# Altium schematic sheet [1X - JTAG, DEBUG.SchDoc
size 513 x 386 mm
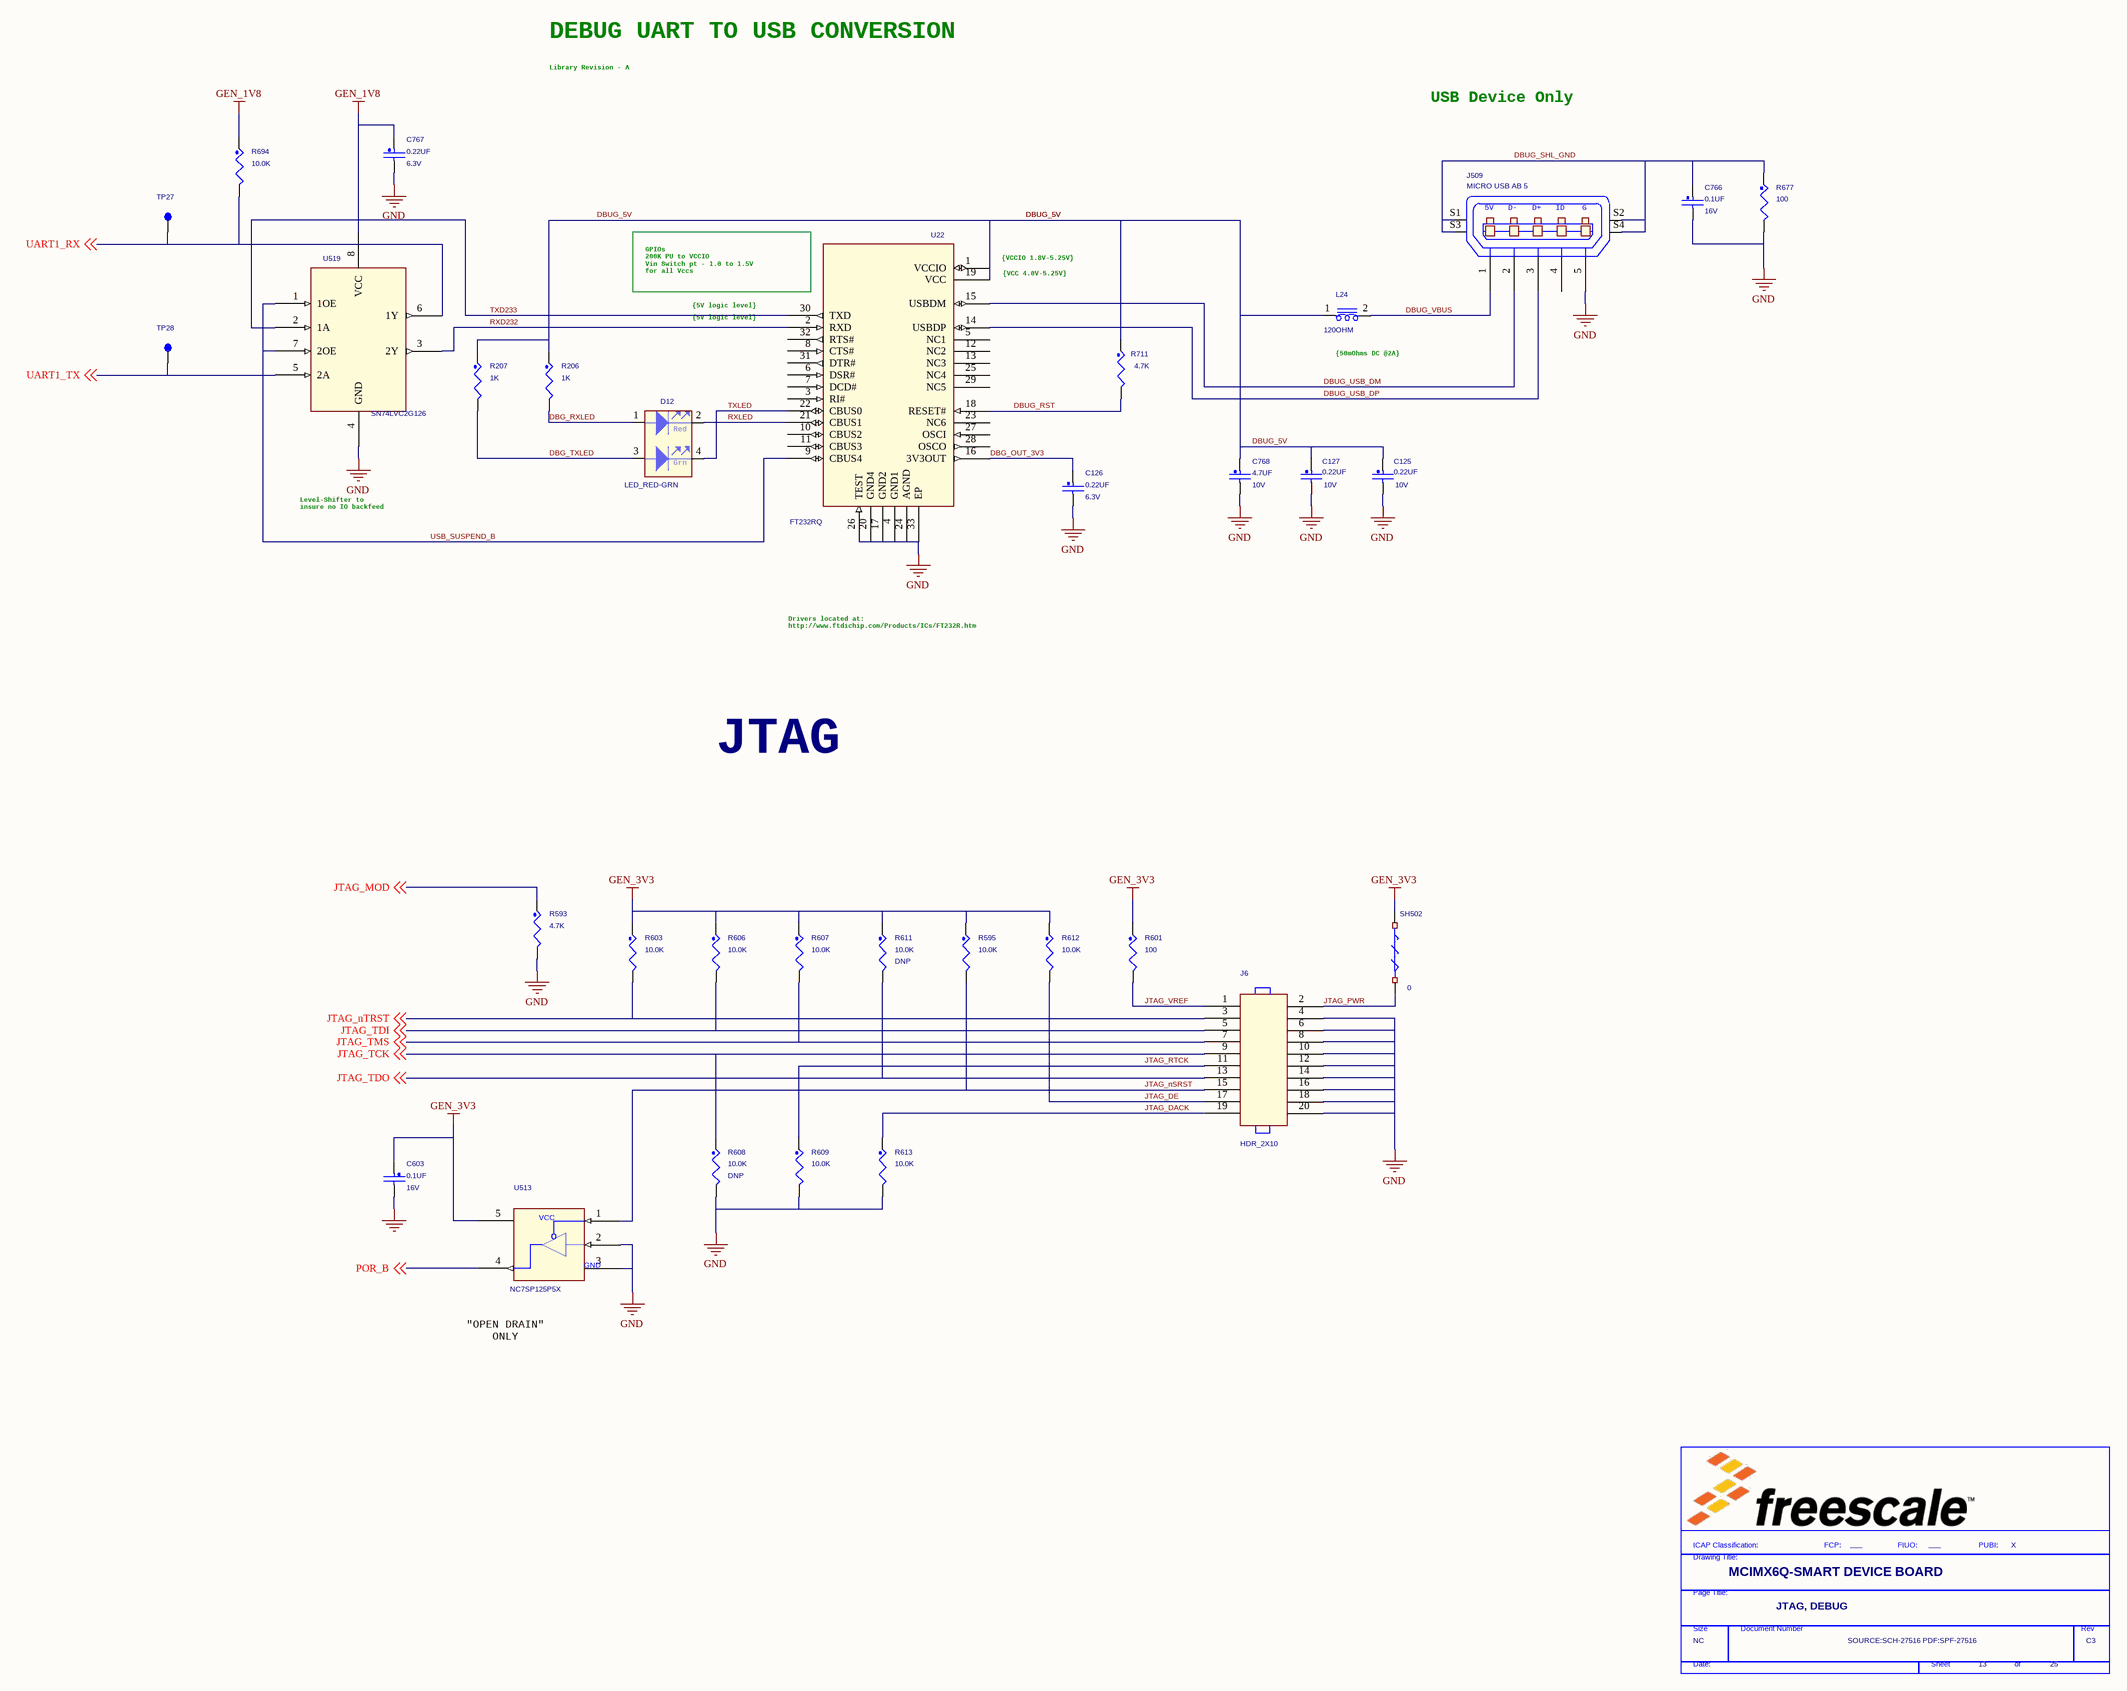
[diagram p0: [1X - JTAG, DEBUG.SchDoc]

## Parts
*  FIUO: ___  PUBI: X  Doc: SOURCE:SCH-27516 PDF:SPF-27516  RevCode: C3  Title: MCIMX6Q-SMART DEVICE BOARD  Page Size: NC  Page Number: 13  Page Count: 25  PageTitle: JTAG, DEBUG  (hidden comment: TitleBlock_FS)  (graphical)
C125  0.22UF  VOLTAGE: 10V  [0201_CC]
C126  0.22UF  Voltage: 6.3V  [0201_CC]
C127  0.22UF  VOLTAGE: 10V  [0201_CC]
C603  0.1UF  WVDC: 16V  [0402_CC]
C766  0.1UF  WVDC: 16V  [0402_CC]
C767  0.22UF  Voltage: 6.3V  [0201_CC]
C768  4.7UF  WVDC: 10V  [0603_CC]
D12  LED_RED-GRN  [LED_DUAL_3025MM_SM]
J6  HDR_2X10  [hdr_20m_100_th]
J509  MICRO USB AB 5  [con5_microusb]
L24  120OHM  [0603_CC]
R206  1K  [0201_CC]
R207  1K  [0201_CC]
R593  4.7K  [0402_CC]
R595  10.0K  [0402_CC]
R601  100  [0402_CC]
R603  10.0K  [0402_CC]
R606  10.0K  [0402_CC]
R607  10.0K  [0402_CC]
R608  10.0K  ASSY_OPT: DNP  [0402_CC]
R609  10.0K  [0402_CC]
R611  10.0K  ASSY_OPT: DNP  [0402_CC]
R612  10.0K  [0402_CC]
R613  10.0K  [0402_CC]
R677  100  [0402_CC]
R694  10.0K  [0402_CC]
R711  4.7K  [0402_CC]
SH502  0  [SH0402_CC]
TP27  TEST POINT  [C035S]  (value not drawn)
TP28  TEST POINT  [C035S]  (value not drawn)
U22  FT232RQ  [qfn32_mc1320x]
U513  NC7SP125P5X  [SC70-5_A]
U519  SN74LVC2G126  [SSOP8]

## Nets
GEN_1V8: C767.1 R694.1 U519.8(VCC)
GEN_3V3: C603.1 R595.1 R601.1 R603.1 R606.1 R607.1 R611.1 R612.1 SH502.1 U513.5(VCC)
GND: C125.2 C126.2 C127.2 C603.2 C766.2 C767.2 C768.2 J6.4 J6.6 J6.8 J6.10 J6.12 J6.14 J6.16 J6.18 J6.20 J509.5(P5) R593.2 R608.2 R609.2 R613.2 R677.2 U22.4(GND1) U22.17(GND2) U22.20(GND4) U22.24(AGND) U22.26(TEST) U22.33(EP) U513.2(A) U513.3(GND) U519.4(GND)
DBG_OUT_3V3: C126.1 U22.16(3V3OUT)
DBG_RXLED: D12.1(ANODE1) R206.2
DBG_TXLED: D12.3(ANODE2) R207.2
DBUG_5V: C125.1 C127.1 C768.1 L24.1 R206.1 R207.1 R711.1 U22.1(VCCIO) U22.19(VCC)
DBUG_RST: R711.2 U22.18(RESET#)
DBUG_SHL_GND: C766.1 J509.S1(SHLD1) J509.S2(SHLD2) J509.S3(SHLD3) J509.S4(SHLD4) R677.1
DBUG_USB_DM: J509.2(P2) U22.15(USBDM)
DBUG_USB_DP: J509.3(P3) U22.14(USBDP)
DBUG_VBUS: J509.1(P1) L24.2
JTAG_DACK: J6.19 R613.1
JTAG_DE: J6.17 R612.2
JTAG_MOD: R593.1 ; off-sheet JTAG_MOD
JTAG_nSRST: J6.15 R595.2 U513.1(~{OE})
JTAG_nTRST: J6.3 R603.2 ; off-sheet JTAG_nTRST
JTAG_PWR: J6.2 SH502.2
JTAG_RTCK: J6.11 R609.1
JTAG_TCK: J6.9 R608.1 ; off-sheet JTAG_TCK
JTAG_TDI: J6.5 R606.2 ; off-sheet JTAG_TDI
JTAG_TDO: J6.13 R611.2 ; off-sheet JTAG_TDO
JTAG_TMS: J6.7 R607.2 ; off-sheet JTAG_TMS
JTAG_VREF: J6.1 R601.2
POR_B: U513.4(Y) ; off-sheet POR_B
RXD232: U22.2(RXD) U519.3(2Y)
RXLED: D12.2(CATHODE1) U22.21(CBUS1)
TXD233: U22.30(TXD) U519.2(1A)
TXLED: D12.4(CATHODE2) U22.22(CBUS0)
UART1_RX: R694.2 TP27.1(Pin1) U519.6(1Y) ; off-sheet UART1_RX
UART1_TX: TP28.1(Pin1) U519.5(2A) ; off-sheet UART1_TX
USB_SUSPEND_B: U22.9(CBUS4) U519.1(1OE) U519.7(2OE)

Not connected (* = marked no-connect by the designer): J509 4(P4); U22 3(RI#) 5(NC1) 6(DSR#) 7(DCD#) 8(CTS#) 10(CBUS2) 11(CBUS3) 12(NC2) 13(NC3) 23(NC6) 25(NC4) 27(OSCI) 28(OSCO) 29(NC5) 31(DTR#) 32(RTS#)

## Notes on the sheet
- DEBUG UART TO USB CONVERSION
- Library Revision - A
- USB Device Only
- (near U22) GPIOs
  200K PU to VCCIO
  Vin Switch pt - 1.0 to 1.5V
  for all Vccs
- {VCCIO 1.8V-5.25V}
- {VCC 4.0V-5.25V}
- {5V logic level}
- (near L24) {50mOhms DC @2A}
- Level-Shifter to
  insure no IO backfeed
- Drivers located at:
  http://www.ftdichip.com/Products/ICs/FT232R.htm
- JTAG
- "OPEN DRAIN"
  ONLY
- (in symbol LED_DUAL_SEP_RG) Red; Grn
- (in symbol TitleBlock_FS) ICAP Classification:; FCP:; FIUO:; PUBI:; Drawing Title:; Page Title:; Size; Document Number; Rev; Date:; Sheet; of
- (in symbol USB_MINI_AB_RECEPTACLE) 5V; D-; D+; ID; G

## Library data of the parts
* = TitleBlock_FS: OrgAddr2: Austin, TX 78735-8598; OrgAddr1: 6501 William Cannon Drive West; OrgName: Freescale Semiconductor; FCP: ___; Page Create Date: March  8, 1995
C125 = CAP_NP: CAP CER 0.22UF 10V 20% X5R 0201; CLASS: DISCRETE; SIGNAL_MODEL: DEFAULT_CAPACITOR_220000pF_2_1; FPLIST: CC0201,CC0201_HD,0201_CC,CC_0201_CIR,0201_CC_012SM; CAD_APPROVED: Yes; MFG_PN01: LMK063BJ224MP-F; MFG_NAME01: Taiyo Yuden; AGILE_PN: 150-78815; HEIGHT: 0.33MM; ROHS: Yes; Tolerance: 20%
C126 = CAP_NP: CAP CER 0.22UF 6.3V 20% X5R 0201; CLASS: DISCRETE; SIGNAL_MODEL: DEFAULT_CAPACITOR_220000pF_2_1; ROOM: CPU; AGILE_PN: 150-77852; MFG_NAME01: TAIYO YUDEN; MFG_PN01: JMK063BJ224MP-F; CAD_APPROVED: Yes; FPLIST: CC0201,CC0201_HD,0201_CC; PRIORITY_PN: 021-00278; Tolerance: 20%; ROHS: Yes; HEIGHT: 0.33 MM
C127 = CAP_NP: CAP CER 0.22UF 10V 20% X5R 0201; CLASS: DISCRETE; SIGNAL_MODEL: DEFAULT_CAPACITOR_220000pF_2_1; AGILE_PN: 150-78815; MFG_NAME01: Taiyo Yuden; MFG_PN01: LMK063BJ224MP-F; CAD_APPROVED: Yes; FPLIST: CC0201,CC0201_HD,0201_CC,CC_0201_CIR,0201_CC_012SM; Tolerance: 20%; ROHS: Yes; HEIGHT: 0.33MM
C603 = CAP_NP: CAP CER 0.1UF 16V 10% X7R 0402; CLASS: DISCRETE; SIGNAL_MODEL: DEFAULT_CAPACITOR_100000pF_2_1; FPLIST: CC0402_25,CC0402_HD,0402_CC; CAD_APPROVED: Yes; MFG_PN01: C0402C104K4RAC; MFG_NAME01: KEMET; AGILE_PN: 150-75182; HEIGHT: 0.635MM; ROHS: Yes; Tolerance: 10%; VOLTAGE: 16V
C766 = CAP_NP: CAP CER 0.1UF 16V 10% X7R 0402; CLASS: DISCRETE; SIGNAL_MODEL: DEFAULT_CAPACITOR_100000pF_2_1; AGILE_PN: 150-75182; MFG_NAME01: KEMET; MFG_PN01: C0402C104K4RAC; CAD_APPROVED: Yes; FPLIST: CC0402_25,CC0402_HD,0402_CC; Tolerance: 10%; ROHS: Yes; HEIGHT: 0.635MM; VOLTAGE: 16V
C767 = CAP_NP: CAP CER 0.22UF 6.3V 20% X5R 0201; CLASS: DISCRETE; SIGNAL_MODEL: DEFAULT_CAPACITOR_220000pF_2_1; PRIORITY_PN: 021-00278; FPLIST: CC0201,CC0201_HD,0201_CC; CAD_APPROVED: Yes; MFG_PN01: JMK063BJ224MP-F; MFG_NAME01: TAIYO YUDEN; AGILE_PN: 150-77852; ROOM: CPU; HEIGHT: 0.33 MM; ROHS: Yes; Tolerance: 20%
C768 = CAP_NP: CAP CER 4.7UF 10V 10% X5R 0603; CLASS: DISCRETE; SIGNAL_MODEL: DEFAULT_CAPACITOR_220000pF_2_1; ROOM: CPU; AGILE_PN: 150-77975; MFG_NAME01: TAIYO YUDEN; MFG_PN01: LMK107BJ475KA-T; CAD_APPROVED: Yes; FPLIST: CC0603_OV,CC0603,0603_CC; Tolerance: 10%; ROHS: Yes; HEIGHT: 0.9MM; TOL: 10%; VOLTAGE: 10V
D12 = LED_DUAL_SEP_RG: LED RED GRN DUAL 30/25MA SMT; CLASS: IC; AGILE_PN: 370-75097; MFG_NAME01: KINGBRIGHT; MFG_PN01: APB3025ESGC-F01; CAD_APPROVED: Yes; ROHS: Yes; HEIGHT: 1.1MM
J6 = HDR_2X10: HDR 2X10 TH SHRD 100MIL CTR 393H AU 120L; CLASS: IO; AGILE_PN: 210-79722; MFG_NAME01: Tyco Electronics; MFG_PN01: 5103308-5; CAD_APPROVED: Yes; ROHS: Yes; HEIGHT: 9.98MM
J509 = USB_MINI_AB_RECEPTACLE: CON 1X5 USB_MICRO_AB_RECEPTACLE RA SMT 0.65MM SP 105H AU; CLASS: IO; FPLIST: con5_microusb,con5_microusb_cust; CAD_APPROVED: Yes; MFG_PN01: 47589-0001; MFG_NAME01: Molex; AGILE_PN: 211-78722; HEIGHT: 2.65MM; ROHS: Yes
L24 = BEAD_0: IND FER BEAD 120OHM@100MHZ 2A 25% 0603; PART_TYPE: FERRITE; CLASS: DISCRETE; PRIORITY_PN: 024-00067; MFG_NAME01: MURATA; CAD_APPROVED: Yes; FPLIST: IND_0603,0603_CC; AGILE_PN: 180-30008; MFG_PN01: BLM18PG121SH1; ROOM: RGMII_PHY; Tolerance: 25%; HEIGHT: 0.95MM; ROHS: Yes
R206 = RES: RES MF 1.0K 1/20W 5% 0201; CLASS: DISCRETE; SIGNAL_MODEL: DEFAULT_RESISTOR_1000OHM_2_1; AGILE_PN: 470-79245; MFG_NAME01: KOA SPEER; MFG_PN01: RK73B1HTTC102J; CAD_APPROVED: Yes; FPLIST: RC0201,0201_CC; Tolerance: 5%; ROHS: Yes
R207 = RES: RES MF 1.0K 1/20W 5% 0201; CLASS: DISCRETE; SIGNAL_MODEL: DEFAULT_RESISTOR_1000OHM_2_1; FPLIST: RC0201,0201_CC; CAD_APPROVED: Yes; MFG_PN01: RK73B1HTTC102J; MFG_NAME01: KOA SPEER; AGILE_PN: 470-79245; ROHS: Yes; Tolerance: 5%
R593 = RES: RES MF 4.70K 1/16W 1% 0402; CLASS: DISCRETE; SIGNAL_MODEL: DEFAULT_RESISTOR_4700OHM_2_1; ROOM: MARLEY; PRIORITY_PN: 006-00619; CAD_APPROVED: Yes; MFG_PN01: RK73H1ETTP4701F; MFG_NAME01: KOA SPEER; AGILE_PN: 470-75418; ROHS: Yes; Tolerance: 1%
R595 R603 R606-R609 R611 R612 = RES: RES MF 10.0K 1/16W 1% 0402; CLASS: DISCRETE; SIGNAL_MODEL: DEFAULT_RESISTOR_10000OHM_2_1; FPLIST: RC0402_25,RC0402_HD,0402_CC; CAD_APPROVED: Yes; MFG_PN01: CRCW040210K0FKED; MFG_NAME01: VISHAY INTERTECHNOLOGY; AGILE_PN: 470-75416; ROHS: Yes; Tolerance: 1%
R601 = RES: RES MF 100 OHM 1/16W 1% 0402; CLASS: DISCRETE; SIGNAL_MODEL: DEFAULT_RESISTOR_100OHM_2_1; FPLIST: RC0402_25,RC0402_HD,0402_CC; CAD_APPROVED: Yes; MFG_PN01: CR-02FL6--100R; MFG_NAME01: THYE MING TECH CO LTD; AGILE_PN: 470-30454; ROHS: Yes; Tolerance: 1%
R613 R694 = RES: RES MF 10.0K 1/16W 1% 0402; CLASS: DISCRETE; SIGNAL_MODEL: DEFAULT_RESISTOR_10000OHM_2_1; AGILE_PN: 470-75416; MFG_NAME01: VISHAY INTERTECHNOLOGY; MFG_PN01: CRCW040210K0FKED; CAD_APPROVED: Yes; FPLIST: RC0402_25,RC0402_HD,0402_CC; Tolerance: 1%; ROHS: Yes
R677 = RES: RES MF 100 OHM 1/16W 1% 0402; CLASS: DISCRETE; SIGNAL_MODEL: DEFAULT_RESISTOR_100OHM_2_1; AGILE_PN: 470-30454; MFG_NAME01: THYE MING TECH CO LTD; MFG_PN01: CR-02FL6--100R; CAD_APPROVED: Yes; FPLIST: RC0402_25,RC0402_HD,0402_CC; Tolerance: 1%; ROHS: Yes
R711 = RES: RES MF 4.70K 1/16W 1% 0402; CLASS: DISCRETE; SIGNAL_MODEL: DEFAULT_RESISTOR_4700OHM_2_1; FPLIST: RC0402_25,RC0402_HD,0402_CC; CAD_APPROVED: Yes; MFG_PN01: RK73H1ETTP4701F; MFG_NAME01: KOA SPEER; AGILE_PN: 470-75418; ROHS: Yes; Tolerance: 1%
SH502 = RES_SHORT-2: ZERO OHM CUT TRACE 0402 PADS; NO PART TO ORDER; CLASS: DISCRETE; AGILE_PN: 470-76449; MFG_NAME01: LAYOUT ELEMENT ONLY; ASSY_OPT: DNP; CAD_APPROVED: Yes; FPLIST: SH0402,SH0402_CC; MFG_PN01: LAYOUT ELEMENT ONLY; ROHS: Yes
TP27 = Test pad: TEST POINT PAD 35 MIL SMT, NO PART TO ORDER; CLASS: IC; CAD_APPROVED: Yes; ASSY_OPT: DNP; MFG_PN01: NA; AGILE_PN: 280-75148; ROOM: ATLAS-AP; HEIGHT: 0.1 MM; ROHS: Yes; MFG_NAME01: NA
TP28 = Test pad: TEST POINT PAD 35 MIL SMT, NO PART TO ORDER; CLASS: IC; ROOM: ATLAS-AP; AGILE_PN: 280-75148; MFG_NAME01: NA; ASSY_OPT: DNP; CAD_APPROVED: Yes; MFG_PN01: NA; ROHS: Yes; HEIGHT: 0.1 MM
U22 = FT232RQ: IC XCVR USB TO UART CTLR 3.3-5.25V QFN32; AGILE_PN: 312-77380; MFG_NAME01: FUTURE TECHNOLOGY DEVICES INTERNATIONAL LTD.; CAD_APPROVED: Yes; CLASS: IC; MFG_PN01: FT232RQ; ROHS: Yes; HEIGHT: 1.05MM
U513 = 1G125: IC BUF TS 0.9-3.6V; CAD_APPROVED: Yes; MFG_NAME01: FAIRCHILD; AGILE_PN: 312-30153; CLASS: IC; HEIGHT: 1.1MM; ROHS: Yes; MFG_PN01: NC7SP125P5X
U519 = SN74LVC2G126DCTR: IC BUF DUAL TS 1.65-5.5V SSOP8; AGILE_PN: 315-76544; MFG_NAME01: TEXAS INSTRUMENTS; CAD_APPROVED: Yes; CLASS: IC; MFG_PN01: SN74LVC2G126DCTR; ROHS: Yes; HEIGHT: 1.30MM